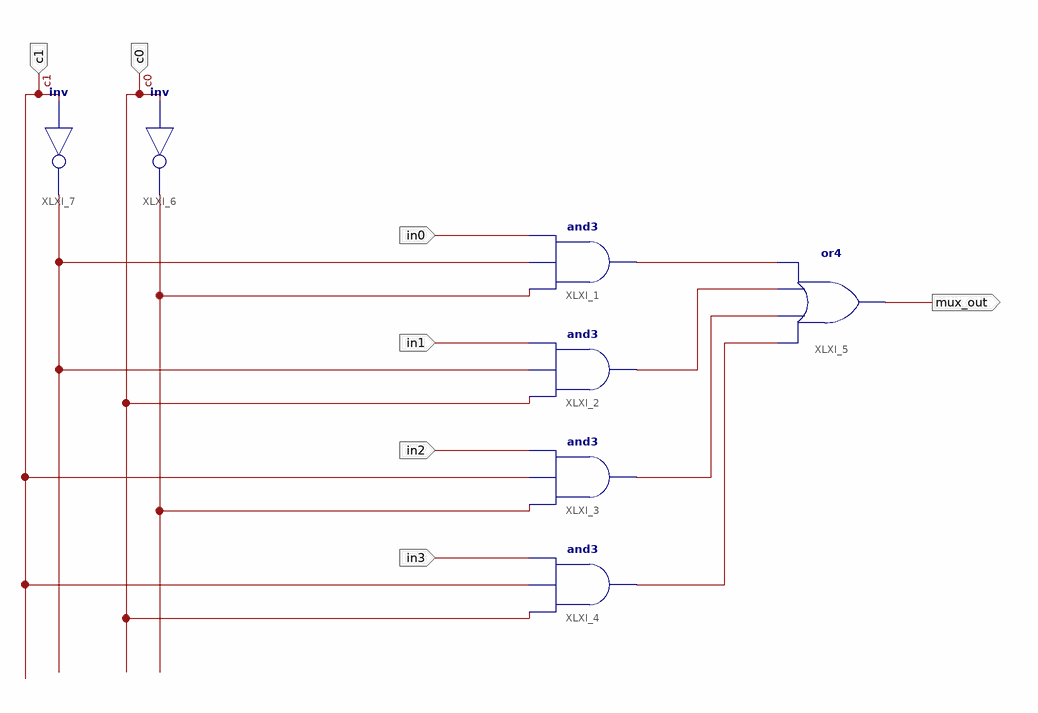
[diagram p0: schematic sheet 1]
// Xilinx ISE schematic mux4_sch.sch (spartan2e) as structural Verilog: 7 symbols, 7 ports
module mux4_sch (
  input  c1,
  input  in3,
  input  in2,
  input  in1,
  input  in0,
  input  c0,
  output mux_out
);

  wire XLXN_1, XLXN_2, XLXN_4, XLXN_5, XLXN_6, XLXN_7;

  not XLXI_6 (XLXN_6, c0);
  not XLXI_7 (XLXN_7, c1);
  or XLXI_5 (mux_out, XLXN_5, XLXN_4, XLXN_2, XLXN_1);
  and XLXI_4 (XLXN_5, c0, c1, in3);
  and XLXI_3 (XLXN_4, XLXN_6, c1, in2);
  and XLXI_2 (XLXN_2, c0, XLXN_7, in1);
  and XLXI_1 (XLXN_1, XLXN_6, XLXN_7, in0);
endmodule
